# EAGLE design Temp Schematic (EAGLE 9.6.2)
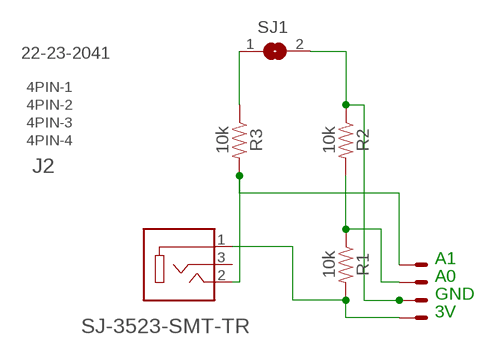
[diagram p0: schematic, sheet 1]

## Parts
4PIN  22-23-2041  [22-23-2041]
J2  SJ-3523-SMT-TR  [CUI_SJ-3523-SMT-TR]
R1  10k  10KOHM-HORIZ-1/4W-5%  [AXIAL-0.3]
R2  10k  10KOHM-HORIZ-1/4W-5%  [AXIAL-0.3]
R3  10k  10KOHM-HORIZ-1/4W-5%  [AXIAL-0.3]
SJ1  SJ  [SJ]

## Nets
GND: 4PIN.3 R2.P$1 SJ1.2
N$1: 4PIN.4 J2.1 R1.P$2
N$3: 4PIN.2 R1.P$1 R2.P$2
N$4: R3.P$1 SJ1.1
N$6: 4PIN.1 J2.2 R3.P$2
Unconnected: J2.3

## Notes on the sheet
- A1
- A0
- GND
- 3V

## Library data of the parts
4PIN = con-molex:22-23-2041: .100" (2.54mm) Center Header - 4 Pin; MF: MOLEX; MPN: 22-23-2041; OC_FARNELL: 1462920; OC_NEWARK: 38C0355
J2 = SJ-3523-SMT-TR:SJ-3523-SMT-TR: Audio Jack Connector 3.5 mm Low Profile Surface Mount Stereo Jack, 3 Pin Right-Angle Check availability <https://pricing.snapeda.com/parts/SJ-3523-SMT-TR/CUI%20Devices/view-part?ref=eda>; AVAILABILITY: In Stock; CUI_PURCHASE_URL: https://www.cuidevices.com/product/interconnect/connectors/audio-connectors/jacks/sj-352x-smt-series?utm_source=snapeda.com&utm_medium=referral&utm_campaign=snapedaBOM; DESCRIPTION: 3.5 mm, Stereo, Right Angle, Surface Mount (SMT), 3 Conductors, 0~1 Internal Switches, Audio Jack Connector; MF: CUI Devices; MP: SJ-3523-SMT-TR; PACKAGE: None; PRICE: None; PURCHASE-URL: https://pricing.snapeda.com/search/part/SJ-3523-SMT-TR/?ref=eda
R1-R3 = SparkFun-Resistors:10KOHM: 10kΩ resistor A resistor is a passive two-terminal electrical component that implements electrical resistance as a circuit element. Resistors act to reduce current flow, and, at the same time, act to lower voltage levels within circuits. - Wikipedia; PROD_ID: RES-09435
SJ1 = jumper:SJ: SMD solder JUMPER

## Board
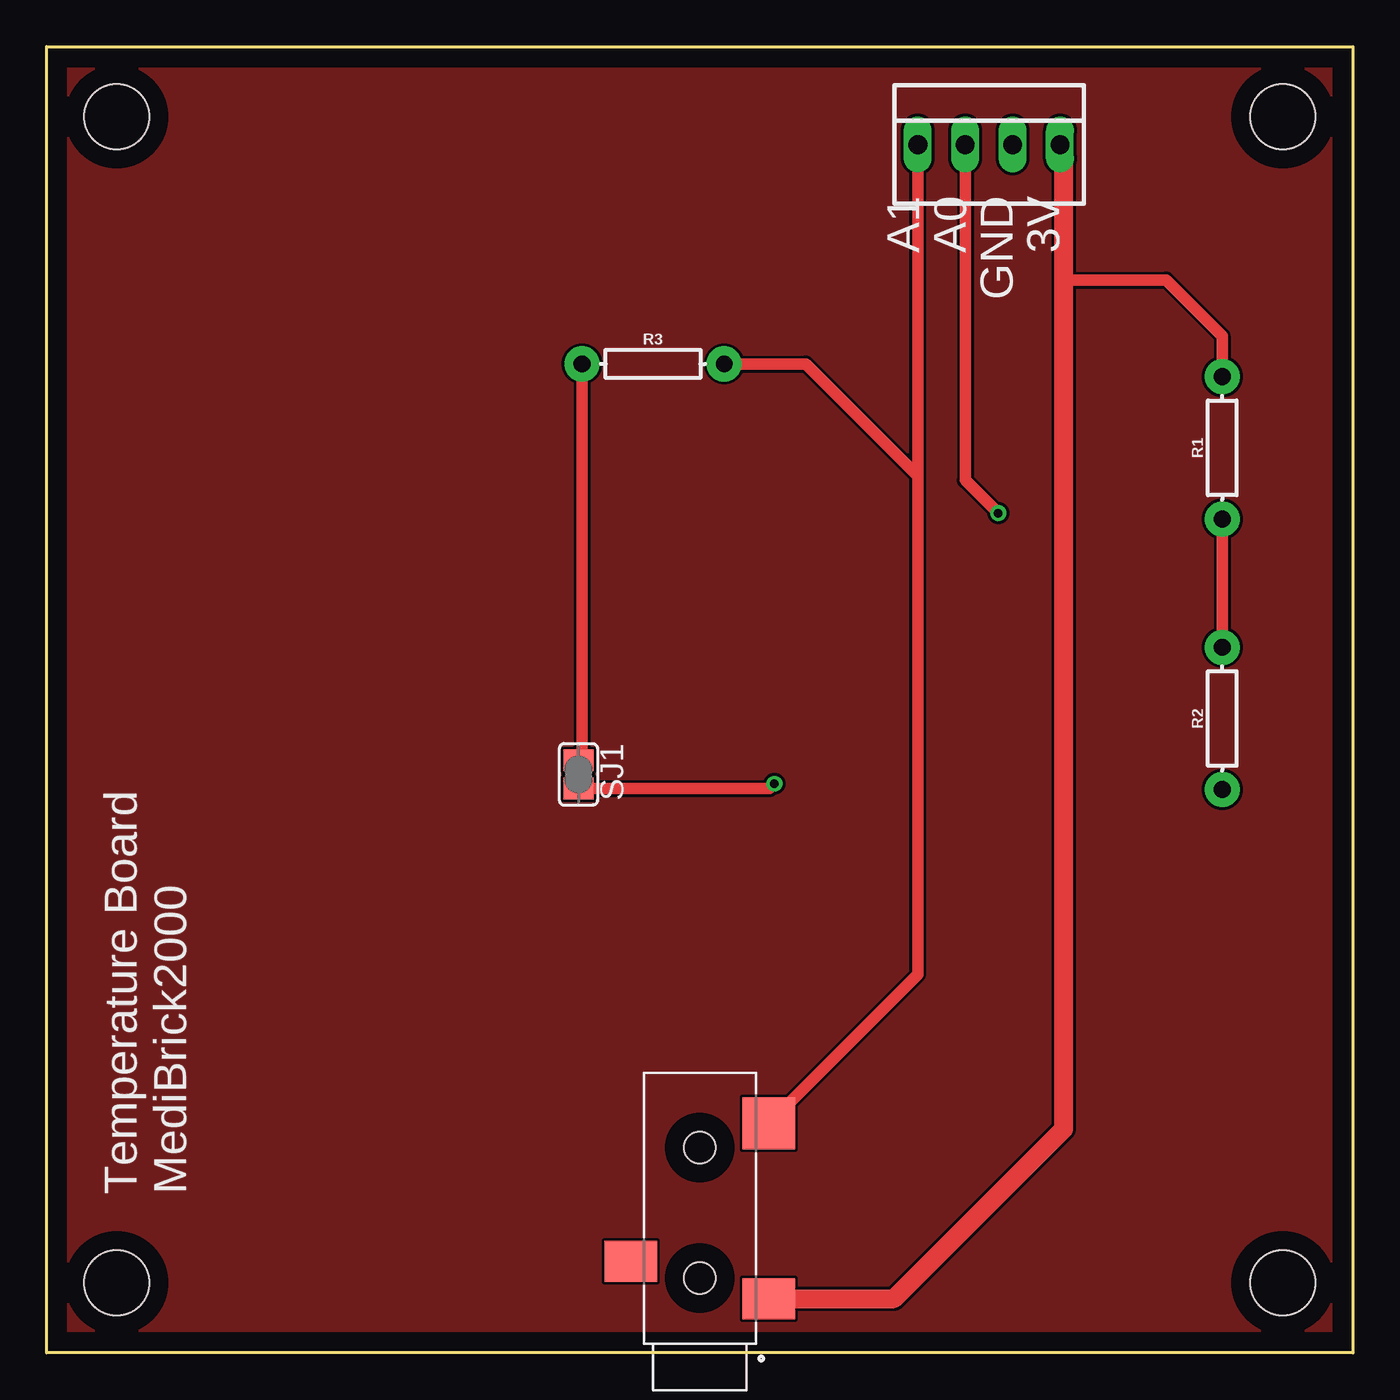
[diagram p1: board, top side]
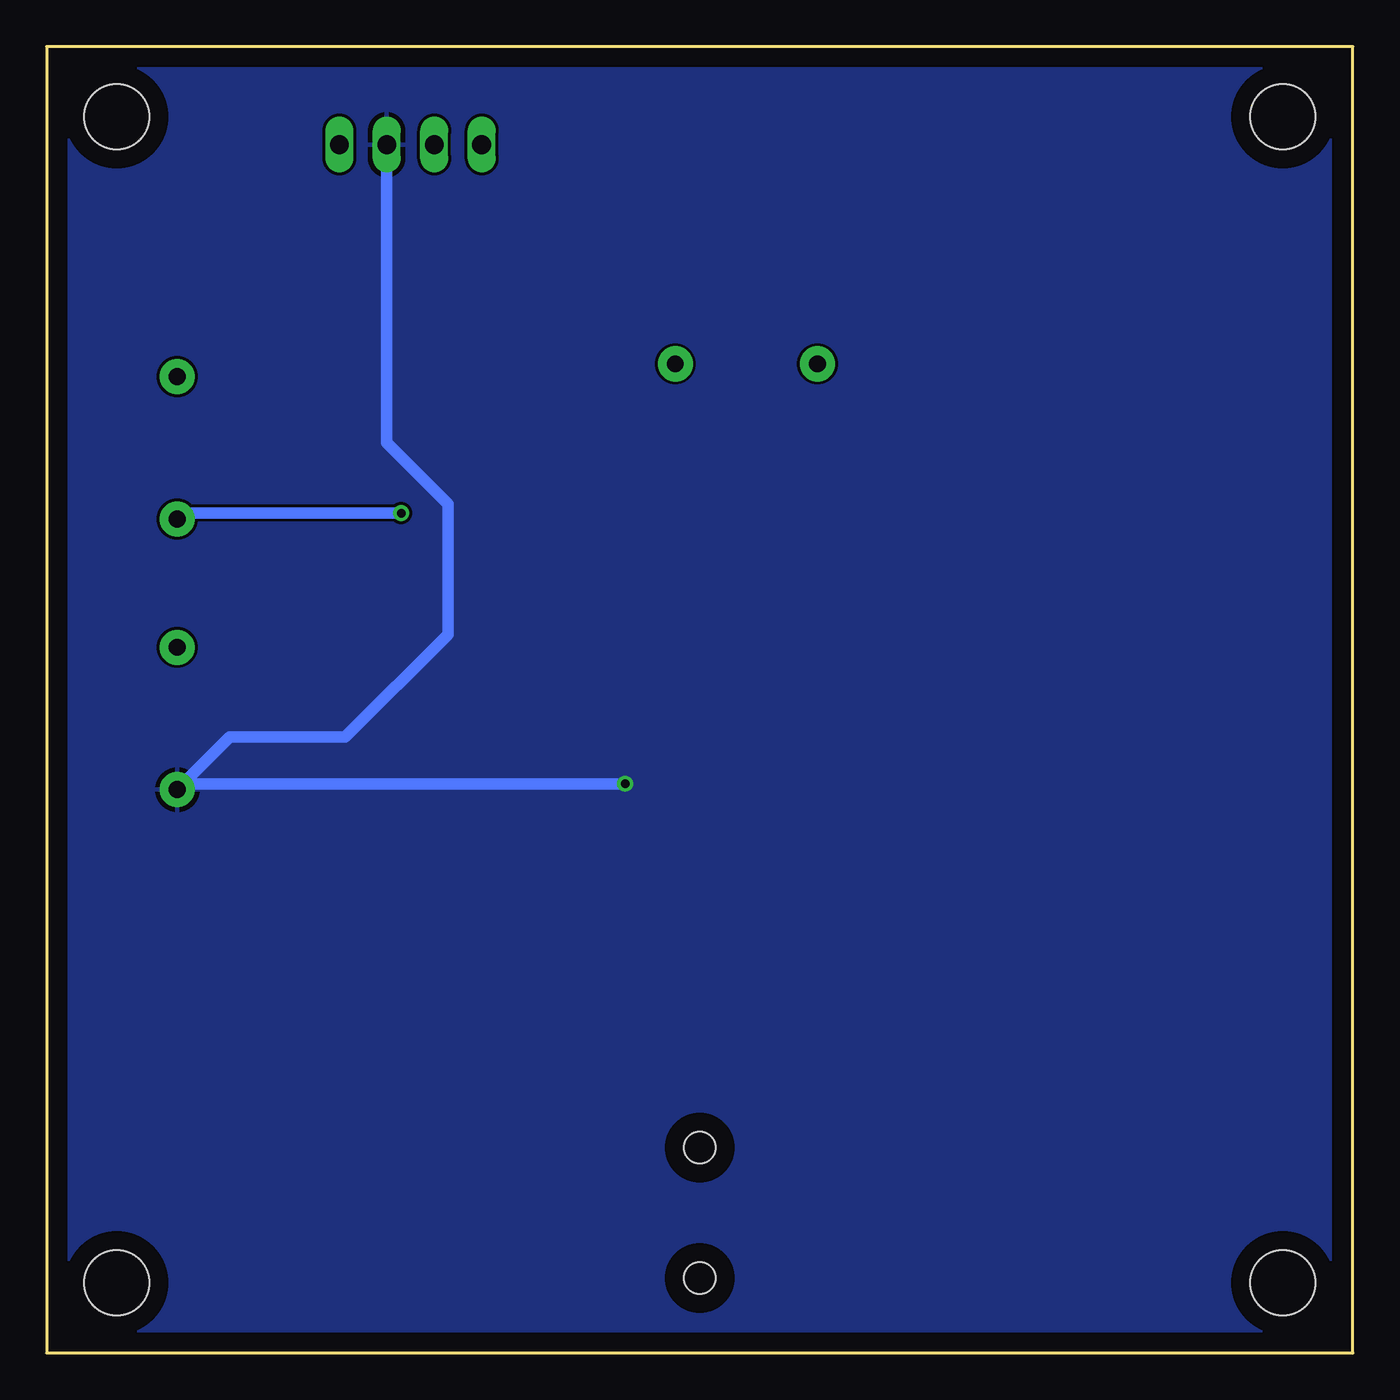
[diagram p2: board, bottom side, seen from below]

Size 70 x 70 mm. Coordinates in mm from the lower left corner, seen from the top.
Outline: 0,0 0,70 70,70 70,0 0,0
Copper layers (1*16): Top 0.035mm / dielectric 1.5mm / Bottom 0.035mm
Design rules "default": minimum track width 6mil, minimum drill 0.35mm, track to track 6mil, track to pad 6mil, pad to pad 6mil, via to via 6mil, smd to smd 6mil, copper to edge 40mil, drill to drill 6mil, minimum pad ring 10mil, minimum via ring 8mil, stop-mask expansion 4mil, vias tented up to drill 0mil, thermal gap 10mil
Holes 3.5 mm at 3.75,66.25 66.25,66.25 66.25,3.75 3.75,3.75

### Footprints (pad centres in the part's own frame; a part is rotated, then mirrored left to right if it is on the bottom)
22-23-2041 = drill 1 long: 1 -3.81,0; 2 -1.27,0; 3 1.27,0; 4 3.81,0
CUI_SJ-3523-SMT-TR = smd 2.2 x 2.8: 1 -1.1,-3.7; 3 0.9,3.7 | smd 2.8 x 2.8: 2 8.3,-3.7 | hole 1.7: 0,0; 7,0
AXIAL-0.3 = drill 0.9 pad 1.88: P$1 -3.81,0; P$2 3.81,0
SJ = smd 1.168 x 1.6: 1 -0.762,0; 2 0.762,0

### Placement (x,y rotation side)
4PIN  50.5,64.75 0 top
J2  35,4 90 top
R1  63,48.5 90 top
R2  63,34 90 top
R3  32.5,53 0 top
SJ1  28.5,31 270 top

### Tracks (layer width: path | path; a pad name or v marks a point on that pad's centre or on a via)
3V
  pour Top: 0,0 70,0 70,70 0,70
GND  (via drill 0.45)
  Top 0.61: SJ1.2 38.74,30.24 v39,30.5
  Bottom 0.61: v39,30.5 62.69,30.5 R2.P$1 60.19,33 54,33 48.5,38.5 48.5,45.5 51.77,48.77 4PIN.3
  pour Bottom: 0,0 0,70 70,70 70,0
N$1
  Top 0.61: 54.5,57.5 60,57.5 63,54.5 R1.P$2
  Top 1.016: J2.1 45.4,2.9 54.5,12 54.5,57.5 54.5,64.56 4PIN.4
N$3  (via drill 0.45)
  Top 0.61: 4PIN.2 49.23,46.77 v51,45 | R1.P$1 R2.P$2
  Bottom 0.61: v51,45 62.69,45 R1.P$1
N$4
  Top 0.61: R3.P$1 28.69,31.95 SJ1.1
N$6
  Top 0.61: J2.2 46.69,20.29 46.69,47 | 46.69,47 4PIN.1 | R3.P$2 40.69,53 46.69,47

### Text on the board
tNames: A1 | A0 | GND | 3V | Temperature Board / MediBrick2000